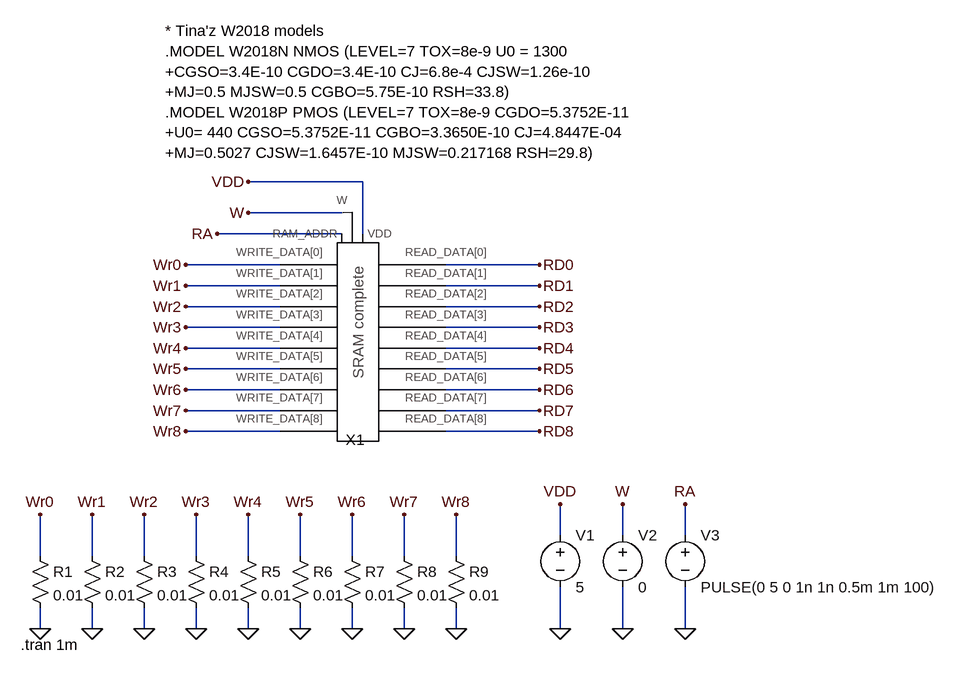
[diagram p0: schematic SRAMcompleteTEST.asc]
SRAMcompleteTEST.asc, the LTspice schematic file:
Version 4
SHEET 1 1160 680
WIRE 272 -48 96 -48
WIRE 240 0 96 0
WIRE 240 32 48 32
WIRE 272 32 272 -48
WIRE 144 80 0 80
WIRE 544 80 400 80
WIRE 144 112 0 112
WIRE 544 112 400 112
WIRE 144 144 0 144
WIRE 544 144 400 144
WIRE 144 176 0 176
WIRE 544 176 400 176
WIRE 144 208 0 208
WIRE 544 208 400 208
WIRE 144 240 0 240
WIRE 544 240 400 240
WIRE 144 272 0 272
WIRE 544 272 400 272
WIRE 144 304 0 304
WIRE 544 304 400 304
WIRE 144 336 0 336
WIRE 544 336 400 336
WIRE 576 496 576 448
WIRE 672 496 672 448
WIRE 768 496 768 448
WIRE -224 528 -224 464
WIRE -144 528 -144 464
WIRE -64 528 -64 464
WIRE 16 528 16 464
WIRE 96 528 96 464
WIRE 176 528 176 464
WIRE 256 528 256 464
WIRE 336 528 336 464
WIRE 416 528 416 464
WIRE -224 640 -224 608
WIRE -144 640 -144 608
WIRE -64 640 -64 608
WIRE 16 640 16 608
WIRE 96 640 96 608
WIRE 176 640 176 608
WIRE 256 640 256 608
WIRE 336 640 336 608
WIRE 416 640 416 608
WIRE 576 640 576 576
WIRE 672 640 672 576
WIRE 768 640 768 576
FLAG 0 80 Wr0
FLAG 0 112 Wr1
FLAG 0 144 Wr2
FLAG 0 176 Wr3
FLAG 0 208 Wr4
FLAG 0 240 Wr5
FLAG 0 272 Wr6
FLAG 0 304 Wr7
FLAG 0 336 Wr8
FLAG 48 32 RA
FLAG 96 0 W
FLAG 96 -48 VDD
FLAG 544 80 RD0
FLAG 544 112 RD1
FLAG 544 144 RD2
FLAG 544 176 RD3
FLAG 544 208 RD4
FLAG 544 240 RD5
FLAG 544 272 RD6
FLAG 544 304 RD7
FLAG 544 336 RD8
FLAG -224 640 0
FLAG -224 464 Wr0
FLAG -144 640 0
FLAG -144 464 Wr1
FLAG -64 640 0
FLAG -64 464 Wr2
FLAG 16 640 0
FLAG 16 464 Wr3
FLAG 96 640 0
FLAG 96 464 Wr4
FLAG 176 640 0
FLAG 176 464 Wr5
FLAG 256 640 0
FLAG 256 464 Wr6
FLAG 336 640 0
FLAG 336 464 Wr7
FLAG 416 640 0
FLAG 416 464 Wr8
FLAG 576 640 0
FLAG 576 448 VDD
FLAG 672 640 0
FLAG 672 448 W
FLAG 768 640 0
FLAG 768 448 RA
SYMBOL SRAMcomplete 256 128 R0
SYMATTR InstName X1
SYMBOL res -240 512 R0
SYMATTR InstName R1
SYMATTR Value 0.01
SYMBOL res -160 512 R0
SYMATTR InstName R2
SYMATTR Value 0.01
SYMBOL res -80 512 R0
SYMATTR InstName R3
SYMATTR Value 0.01
SYMBOL res 0 512 R0
SYMATTR InstName R4
SYMATTR Value 0.01
SYMBOL res 80 512 R0
SYMATTR InstName R5
SYMATTR Value 0.01
SYMBOL res 160 512 R0
SYMATTR InstName R6
SYMATTR Value 0.01
SYMBOL res 240 512 R0
SYMATTR InstName R7
SYMATTR Value 0.01
SYMBOL res 320 512 R0
SYMATTR InstName R8
SYMATTR Value 0.01
SYMBOL res 400 512 R0
SYMATTR InstName R9
SYMATTR Value 0.01
SYMBOL voltage 576 480 R0
SYMATTR InstName V1
SYMATTR Value 5
SYMBOL voltage 672 480 R0
SYMATTR InstName V2
SYMATTR Value 0
SYMBOL voltage 768 480 R0
WINDOW 123 0 0 Left 2
WINDOW 39 0 0 Left 2
SYMATTR InstName V3
SYMATTR Value PULSE(0 5 0 1n 1n 0.5m 1m 100)
TEXT -254 664 Left 2 !.tran 1m
TEXT -32 -280 Left 2 !* Tina'z W2018 models\n.MODEL W2018N NMOS (LEVEL=7 TOX=8e-9 U0 = 1300\n+CGSO=3.4E-10 CGDO=3.4E-10 CJ=6.8e-4 CJSW=1.26e-10\n+MJ=0.5 MJSW=0.5 CGBO=5.75E-10 RSH=33.8)\n.MODEL W2018P PMOS (LEVEL=7 TOX=8e-9 CGDO=5.3752E-11\n+U0= 440 CGSO=5.3752E-11 CGBO=3.3650E-10 CJ=4.8447E-04\n+MJ=0.5027 CJSW=1.6457E-10 MJSW=0.217168 RSH=29.8)

The netlist it stands for:
* SRAMcompleteTEST.asc
XX1 VDD RA Wr0 Wr1 Wr2 Wr3 Wr4 Wr5 Wr6 Wr7 Wr8 RD0 RD1 RD2 RD3 RD4 RD5 RD6 RD7 RD8 W SRAMcomplete  ; pins VDD RAM_ADDR WRITE_DATA[0] WRITE_DATA[1] WRITE_DATA[2] WRITE_DATA[3] WRITE_DATA[4] WRITE_DATA[5] WRITE_DATA[6] WRITE_DATA[7] WRITE_DATA[8] READ_DATA[0] READ_DATA[1] READ_DATA[2] READ_DATA[3] READ_DATA[4] READ_DATA[5] READ_DATA[6] READ_DATA[7] READ_DATA[8] W
R1 Wr0 0 0.01
R2 Wr1 0 0.01
R3 Wr2 0 0.01
R4 Wr3 0 0.01
R5 Wr4 0 0.01
R6 Wr5 0 0.01
R7 Wr6 0 0.01
R8 Wr7 0 0.01
R9 Wr8 0 0.01
V1 VDD 0 5
V2 W 0 0
V3 RA 0 PULSE(0 5 0 1n 1n 0.5m 1m 100)
.tran 1m
* Tina'z W2018 models
.MODEL W2018N NMOS (LEVEL=7 TOX=8e-9 U0 = 1300
+CGSO=3.4E-10 CGDO=3.4E-10 CJ=6.8e-4 CJSW=1.26e-10
+MJ=0.5 MJSW=0.5 CGBO=5.75E-10 RSH=33.8)
.MODEL W2018P PMOS (LEVEL=7 TOX=8e-9 CGDO=5.3752E-11
+U0= 440 CGSO=5.3752E-11 CGBO=3.3650E-10 CJ=4.8447E-04
+MJ=0.5027 CJSW=1.6457E-10 MJSW=0.217168 RSH=29.8)
.backanno
.end